# Altium schematic sheet OIS_Relay.SchDoc
size A4
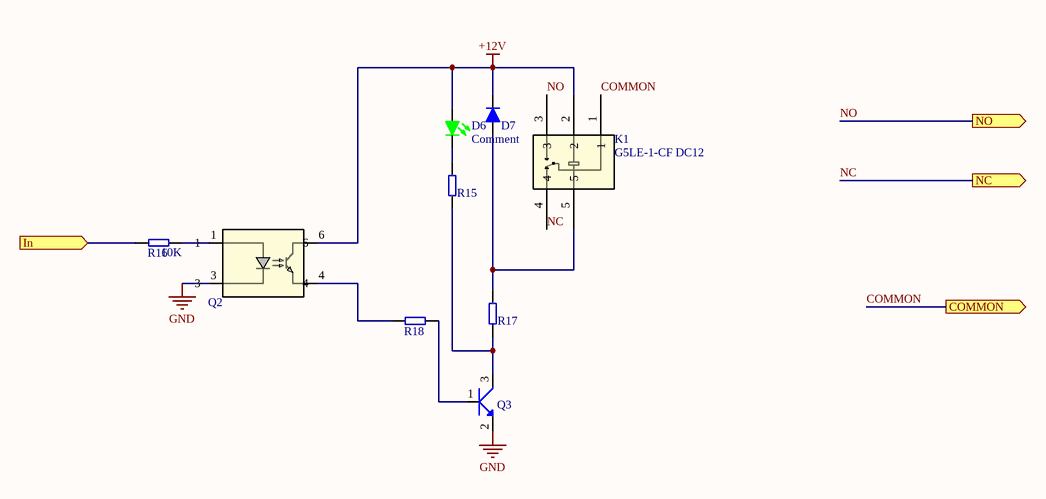
[diagram p0: OIS_Relay.SchDoc]

## Parts
D6  Comment  [L0402_A]
D7  TSSA3U60 R3G  [TAIWAN_TSSA3U60 R3G]  (value not drawn)
K1  G5LE-1-CF DC12  [RELAY_G5LE-1 DC5_OMR]
Q2  TLP188(TPL,E  [OptoCoupler]  (value not drawn)
Q3  MMBT4401-7-F  [SOT-23]  (value not drawn)
R15  1K  [R0402]  (value not drawn)
R16  10K  [R0402]
R17  1K  [R0402]  (value not drawn)
R18  1K  [R0402]  (value not drawn)

## Ports
COMMON (out), In (in), NC (out), NO (out)

## Nets
+12V: D6.A D7.C K1.2 Q2.6
GND: Q2.3 Q3.2(E)
COMMON: K1.1 ; port COMMON
In: R16.1 ; port In
NC: K1.4 ; port NC
NO: K1.3 ; port NO
NetD6_C: D6.C R15.2
NetD7_A: D7.A K1.5 R17.2
NetQ2_1: Q2.1 R16.2
NetQ2_4: Q2.4 R18.1
NetQ3_1: Q3.1(B) R18.2
NetQ3_3: Q3.3(C) R15.1 R17.1

## Library data of the parts
D6 = SML-P12VTT86R: LED RED CLEAR 0402 SMD; Que: 005; Forward Voltage: 2V; Current: 20mA; Part Number: SML-P12VTT86R; Color: Red; Package: 0402 (1006 Metric)
D7 = TSSA3U60 R3G: DIODE SCHOTTKY 60V 3A DO214AC; Manufacturer: Taiwan Semiconductor Corporation; Que: 003; Speed: Fast Recovery =< 500ns, > 200mA (Io); Name: Recep Aydin; Part Number: TSSA3U60 R3G; Diode Type: Schottky; Current: 3A; Package: DO-214AC; Datasheet: https://www.taiwansemi.com/assets/uploads/datasheet/TSSA3U60_F1612.pdf; Manufacturer Part Number: TSSA3U60 R3G
K1 = G5LE-1-CF DC12: Mfr_Name: Omron; Que: 038; Copyright: Copyright (C) 2023 Ultra Librarian. All rights reserved.; Manufacturer_Part_Number: G5LE-1-CF DC12; RefDes: RefDes; Type: DEV; Part Number: G5LE-1-CF DC12
Q2 = TLP188(TPL,E: IC-188 OPTOISO 3.75KV TRANS SO6; Mfr_Name: Toshiba Electronic Devices & Storage Corp.; Type: DEV; Number_devices_in_Package: 1; Que: 012; Copyright: Copyright (C) 2023 Ultra Librarian. All rights reserved.; Manufacturer_Part_Number: TLP188(TPL,E; RefDes: RefDes; Source_Package: TLP188; Part Number: TLP188(TPL,E
Q3 = MMBT4401-7-F: TRANS NPN 40V 0.6A SMD SOT23-3; Manufacturer: Diodes Incorporated; Que: 007; Vce Saturation: 750mV @ 50mA, 500mA; DC Current Gain: 100 @ 150mA, 1V; Frequency: 250Mhz; Name: Recep Aydin; Part Number: MMBT4401-7-F; Type: NPN; Package: SOT-23-3; Datasheet: https://www.diodes.com/assets/Datasheets/ds30039.pdf; Manufacturer Part Number: MMBT4401-7-F
R15 R17 R18 = RT0402BRE071KL: RES SMD 1K OHM 0.1% 1/16W 0402; Manufacturer: Yageo; Que: 015; Name: Recep Aydin; Part Number: RT0402BRE071KL; Tolerance: 0.1%; Resistor Type: Thick Film; Package: 0402; Datasheet: https://www.yageo.com/upload/media/product/productsearch/datasheet/rchip/PYu-RT_1-to-0.01_RoHS_L_12.pdf; Manufacturer Part Number: RT0402BRE071KL
R16 = RC1005F103CS: RES SMD 10K OHM 1% 1/16W 0402; Manufacturer: Samsung Electro-Mechanics; Que: 004; Tolerance: 0.1%; Name: Recep Aydin; Part Number: RC1005F103CS; Resistor Type: Thick Film; Package: 0402; Datasheet: https://media.digikey.com/pdf/Data%20Sheets/Samsung%20PDFs/RC_Series_ds.pdf; Manufacturer Part Number: RC1005F103CS